# EAGLE schematic buttonModule (EAGLE 9.6.2)
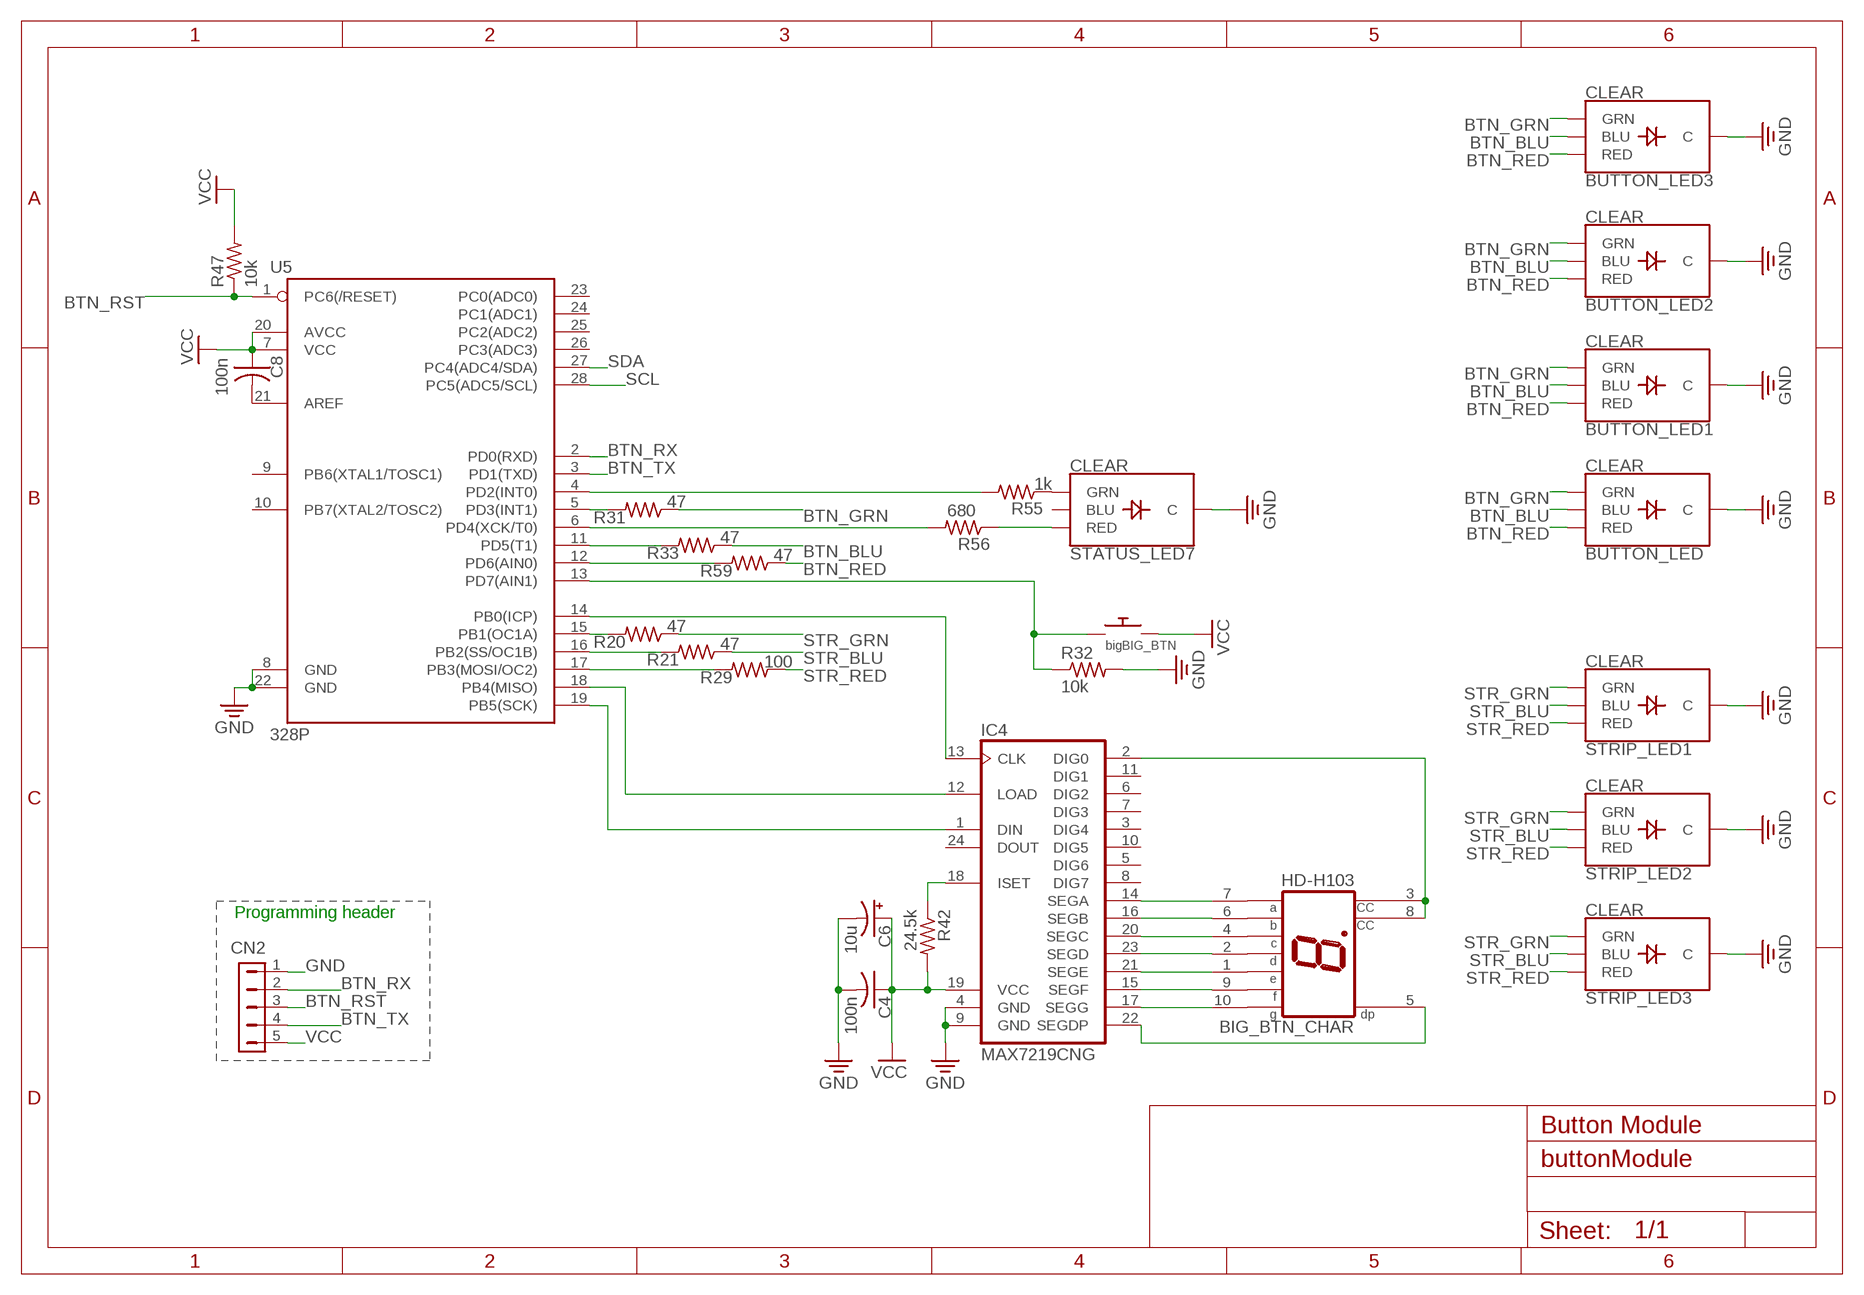
[diagram p0: schematic, sheet 1]

## Parts
BIG_BTN  big  SWITCH_PUSHBUTTONEVQ-PE  [TACT_PANA-EVQ]
BIG_BTN_CHAR  HD-H103  [HDSP-M]
BUTTON_LED  CLEAR  LED-RGB-CCCLEAR  [LED-RGB-THRU]
BUTTON_LED1  CLEAR  LED-RGB-CCCLEAR  [LED-RGB-THRU]
BUTTON_LED2  CLEAR  LED-RGB-CCCLEAR  [LED-RGB-THRU]
BUTTON_LED3  CLEAR  LED-RGB-CCCLEAR  [LED-RGB-THRU]
C4  100n  C-US025-024X044  [C025-024X044]
C6  10u  CPOL-US085CS-1AR  [085CS_1AR]
C8  100n  C-US025-024X044  [C025-024X044]
CN2  HDR-1X5-SIP-100  [SIP-100-5V]
IC4  MAX7219CNG  [DIL24-3]
R20  47  FLIPFLOP-RES  [0805-THM]
R21  47  FLIPFLOP-RES  [0805-THM]
R29  100  FLIPFLOP-RES  [0805-THM]
R31  47  FLIPFLOP-RES  [0805-THM]
R32  10k  R-US_0309/12  [0309/12]
R33  47  FLIPFLOP-RES  [0805-THM]
R42  24.5k  R-US_0309/12  [0309/12]
R47  10k  R-US_0309/12  [0309/12]
R55  1k  FLIPFLOP-RES  [0805-THM]
R56  680  FLIPFLOP-RES  [0805-THM]
R59  47  FLIPFLOP-RES  [0805-THM]
STATUS_LED7  CLEAR  LED-RGB-CCCLEAR  [LED-RGB-THRU]
STRIP_LED1  CLEAR  LED-RGB-CCCLEAR  [LED-RGB-THRU]
STRIP_LED2  CLEAR  LED-RGB-CCCLEAR  [LED-RGB-THRU]
STRIP_LED3  CLEAR  LED-RGB-CCCLEAR  [LED-RGB-THRU]
U5  328P  ATMEGA328P_PDIP  [DIP28]

## Nets
BTN_BLU: BUTTON_LED1.4(BLU) BUTTON_LED2.4(BLU) BUTTON_LED3.4(BLU) BUTTON_LED.4(BLU) R33.1
BTN_GRN: BUTTON_LED1.3(GRN) BUTTON_LED2.3(GRN) BUTTON_LED3.3(GRN) BUTTON_LED.3(GRN) R31.1
BTN_RED: BUTTON_LED1.1(RED) BUTTON_LED2.1(RED) BUTTON_LED3.1(RED) BUTTON_LED.1(RED) R59.1
BTN_RST: CN2.3 R47.1 U5.1(PC6(/RESET))
BTN_RX: CN2.2 U5.2(PD0(RXD))
BTN_TX: CN2.4 U5.3(PD1(TXD))
GND: BUTTON_LED1.2(C) BUTTON_LED2.2(C) BUTTON_LED3.2(C) BUTTON_LED.2(C) C4.2 C6.- CN2.1 IC4.4(GND) IC4.9(GND) R32.2 STATUS_LED7.2(C) STRIP_LED1.2(C) STRIP_LED2.2(C) STRIP_LED3.2(C) U5.8(GND) U5.22(GND)
N$17: R20.2 U5.15(PB1(OC1A))
N$69: R21.2 U5.16(PB2(SS/OC1B))
N$72: R29.2 U5.17(PB3(MOSI/OC2))
N$77: R31.2 U5.5(PD3(INT1))
N$78: R33.2 U5.11(PD5(T1))
N$79: R59.2 U5.12(PD6(AIN0))
N$80: R55.2 U5.4(PD2(INT0))
N$81: BIG_BTN.P$1 R32.1 U5.13(PD7(AIN1))
N$82: BIG_BTN_CHAR.7(A) IC4.14(SEGA)
N$83: R56.2 U5.6(PD4(XCK/T0))
N$84: BIG_BTN_CHAR.6(B) IC4.16(SEGB)
N$85: IC4.13(CLK) U5.14(PB0(ICP))
N$89: BIG_BTN_CHAR.4(C) IC4.20(SEGC)
N$109: C8.2 U5.21(AREF)
N$122: IC4.18(ISET) R42.1
N$123: IC4.1(DIN) U5.19(PB5(SCK))
N$125: IC4.12(LOAD) U5.18(PB4(MISO))
N$126: BIG_BTN_CHAR.2(D) IC4.23(SEGD)
N$129: BIG_BTN_CHAR.1(E) IC4.21(SEGE)
N$130: BIG_BTN_CHAR.9(F) IC4.15(SEGF)
N$131: BIG_BTN_CHAR.10(G) IC4.17(SEGG)
N$132: BIG_BTN_CHAR.5(DP) IC4.22(SEGDP)
N$133: BIG_BTN_CHAR.3(CC) BIG_BTN_CHAR.8(CC) IC4.2(DIG0)
N$154: R55.1 STATUS_LED7.3(GRN)
N$155: R56.1 STATUS_LED7.1(RED)
SCL: U5.28(PC5(ADC5/SCL))
SDA: U5.27(PC4(ADC4/SDA))
STR_BLU: R21.1 STRIP_LED1.4(BLU) STRIP_LED2.4(BLU) STRIP_LED3.4(BLU)
STR_GRN: R20.1 STRIP_LED1.3(GRN) STRIP_LED2.3(GRN) STRIP_LED3.3(GRN)
STR_RED: R29.1 STRIP_LED1.1(RED) STRIP_LED2.1(RED) STRIP_LED3.1(RED)
VCC: BIG_BTN.P$2 C4.1 C6.+ C8.1 CN2.5 IC4.19(VCC) R42.2 R47.2 U5.7(VCC) U5.20(AVCC)
Unconnected: IC4.3(DIG4) IC4.5(DIG6) IC4.6(DIG2) IC4.7(DIG3) IC4.8(DIG7) IC4.10(DIG5) IC4.11(DIG1) IC4.24(DOUT) STATUS_LED7.4(BLU) U5.9(PB6(XTAL1/TOSC1)) U5.10(PB7(XTAL2/TOSC2)) U5.23(PC0(ADC0)) U5.24(PC1(ADC1)) U5.25(PC2(ADC2)) U5.26(PC3(ADC3))

## Notes on the sheet
- Programming header
- Button Module

## Library data of the parts
BIG_BTN = adafruit:SWITCH_PUSHBUTTON: Buttons SOFTTOUCHSMD_SJ - Soft touch temporary push button (Super Junk Akihabara) Compatible with SKPMANE010 [Mouser: 688-SKPMAN] C&K_KSS = Digikey: KSS221GLFS
BIG_BTN_CHAR = display-hp:HD-H103: LED DISPLAY 1-character 7 segment, decimal point right; OC_FARNELL: unknown; OC_NEWARK: unknown
BUTTON_LED BUTTON_LED1-BUTTON_LED3 STATUS_LED7 STRIP_LED1-STRIP_LED3 = SparkFun-LED:LED-RGB-CC: LED-RGB Common Cathode Packages: LED RGB-THRU LED_PIRANHA_5MM SparkFun Products: RGB Diffused Common Cathode- Diffuse <[https://www.sparkfun.com/products/9264]> RGB Diffused Common Cathode - Clear <[https://www.sparkfun.com/products/105]> LED-RGB 5mm Square (Piranha) <[https://www.sparkfun.com/products/11679]>; PROD_ID: DIO-08418
C4 C8 = adafruit:C-US: CAPACITOR, American symbol
C6 = adafruit:CPOL-US: POLARIZED CAPACITOR, American symbol
CN2 = con-hdrs40:HDR-1X5: HEADER CONNECTOR
IC4 = maxim:MAX7219CNG: LED DISPLAY DRIVER; MF: MAXIM; MPN: MAX7219CNG; OC_FARNELL: 1523914; OC_NEWARK: 34C4018
R20 R21 R29 R31 R33 R55 R56 R59 = adafruit:FLIPFLOP-RES: Flip Flop resistor An 0805 resistor inside a standard 1/4W 5% resistor. Makes for easy mods
R32 R42 R47 = adafruit:R-US_: RESISTOR, American symbol
U5 = SparkFun-IC-Microcontroller:ATMEGA328P_PDIP: Atmel 328P Through hole ATMEGA328P uC used in the Arduino 32kb flash, 1k EEPROM, 2k SRAM Datasheet <http://www.sparkfun.com/datasheets/Components/SMD/ATMega328.pdf> SparkFun Products Storefront component: AVR 28 Pin 20MHz 32K 6A/D - ATMega328P <https://www.sparkfun.com/products/9061> (COM-09061) SparkFun Simon Says - Through-Hole Soldering Kit <https://www.sparkfun.com/products/10547> (KIT-10547) SparkFun Learn to Solder - Simon Says <https://www.sparkfun.com/products/13708> (KIT-13708) SparkFun BigTime Watch Kit <https://www.sparkfun.com/products/11734> (KIT-11734) SparkFun ClockIt <https://www.sparkfun.com/products/10930> (KIT-10930) SparkFun Serial Enabled LCD Kit <https://www.sparkfun.com/products/10097> (LCD-10097) SparkFun Simon Tilts - Through Hole Soldering Kit <https://www.sparkfun.com/products/12634> (KIT-12634) SparkFun Frequency Counter Kit <https://www.sparkfun.com/products/10140> (KIT-10140) FabFM Radio Kit <https://www.sparkfun.com/products/11043> (KIT-11043) SparkFun Binary Blaster Kit <https://www.sparkfun.com/products/12037> (KIT-12037) SparkFun Metro-Gnome <https://www.sparkfun.com/products/9236> (KIT-09236) ATmega328 with Arduino Optiboot (Uno) <https://www.sparkfun.com/products/10524> (DEV-10524); PROD_ID: IC-09136